# EAGLE design Window_door_Sensor (EAGLE 6.4)
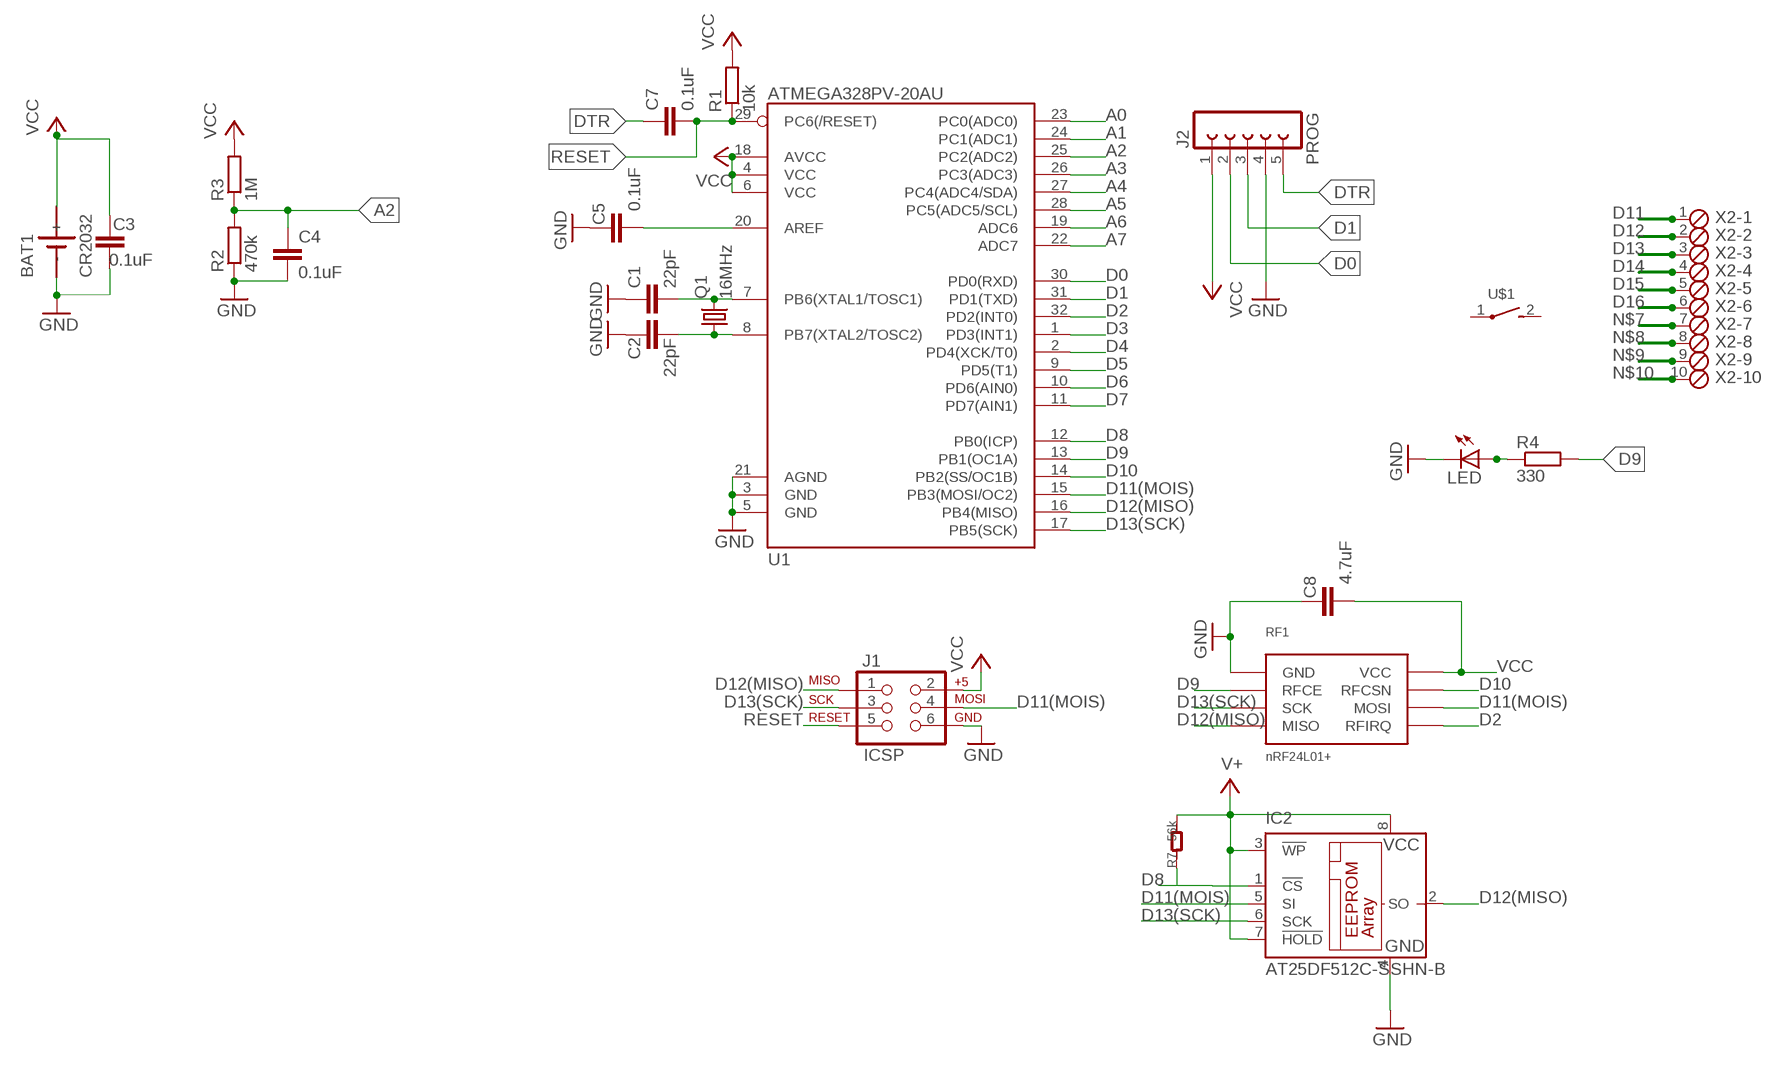
[diagram p0: schematic, sheet 1]

## Parts
BAT1  CR2032  SN2032  [SN2032]
C1  22pF  C-EUC0805  [C0805]
C2  22pF  C-EUC0805  [C0805]
C3  0.1uF  C-EUC0805  [C0805]
C4  0.1uF  C-EUC0805  [C0805]
C5  0.1uF  C-EUC0805  [C0805]
C7  0.1uF  C-EUC0805  [C0805]
C8  4.7uF  C-EUC1206K  [C1206K]
IC2  AT25DF512C-SSHN-B  25AA080SN  [SO-08]
J1  ICSP  AVR_SPI_PRG_6NS  [2X3-NS]
LED  LEDCHIP-LED0805  [CHIP-LED0805]
PROG  J2  FE05-1  [FE05-1]
Q1  16MHz  CRYSTALCTS406  [CTS406]
R1  10k  R-EU_R0805  [R0805]
R2  470k  R-EU_R0805  [R0805]
R3  1M  R-EU_R0805  [R0805]
R4  330  R-EU_R0805  [R0805]
R7  56k  R-0805  [R0805]
RF1  nRF24L01+  NRF24L01  [2X4-2.54MM]
U1  ATMEGA328PV-20AU  ATMEGA328_SMT  [TQFP32-08]
U$1  MK15-B-2""  [16X2,5]
X2  MPT10  [10POL254]

## Nets
A0: U1.23(PC0(ADC0))
A1: U1.24(PC1(ADC1))
A2: C4.1 R2.2 R3.1 U1.25(PC2(ADC2))
A3: U1.26(PC3(ADC3))
A4: U1.27(PC4(ADC4/SDA))
A5: U1.28(PC5(ADC5/SCL))
A6: U1.19(ADC6)
A7: U1.22(ADC7)
D0: PROG.2 U1.30(PD0(RXD))
D1: PROG.3 U1.31(PD1(TXD))
D2: RF1.P$8(RFIRQ) U1.32(PD2(INT0))
D3: U1.1(PD3(INT1))
D4: U1.2(PD4(XCK/T0))
D5: U1.9(PD5(T1))
D6: U1.10(PD6(AIN0))
D7: U1.11(PD7(AIN1))
D8: IC2.1(!CS) R7.1 U1.12(PB0(ICP))
D9: R4.2 RF1.P$3(RFCE) U1.13(PB1(OC1A))
D10: RF1.P$4(RFCSN) U1.14(PB2(SS/OC1B))
D11: X2.1
D11(MOIS): IC2.5(SI) J1.4 RF1.P$6(MOSI) U1.15(PB3(MOSI/OC2))
D12: X2.2
D12(MISO): IC2.2(SO) J1.1 RF1.P$7(MISO) U1.16(PB4(MISO))
D13: X2.3
D13(SCK): IC2.6(SCK) J1.3 RF1.P$5(SCK) U1.17(PB5(SCK))
D14: X2.4
D15: X2.5
D16: X2.6
DTR: C7.1 PROG.5
GND: BAT1.- C1.1 C2.1 C3.1 C4.2 C5.2 C8.2 IC2.4(GND) J1.6 LED.C PROG.4 R2.1 RF1.P$1(GND) U1.3(GND) U1.5(GND) U1.21(AGND)
N$1: C1.2 Q1.3 U1.7(PB6(XTAL1/TOSC1))
N$2: C2.2 Q1.1 U1.8(PB7(XTAL2/TOSC2))
N$5: C5.1 U1.20(AREF)
N$6: LED.A R4.1
N$7: X2.7
N$8: X2.8
N$9: X2.9
N$10: X2.10
RESET: C7.2 J1.5 R1.1 U1.29(PC6(/RESET))
VCC: BAT1.+ C3.2 C8.1 IC2.3(!WP) IC2.7(!HOLD) IC2.8(VCC) J1.2 PROG.1 R1.2 R3.2 R7.2 RF1.P$2(VCC) U1.4(VCC) U1.6(VCC) U1.18(AVCC) ; supply symbol labelled V+
Unconnected: U$1.1(P) U$1.2(S)

## Library data of the parts
BAT1 = sn2032:SN2032: LI BATTERY
C1-C5 C7 C8 = rcl:C-EU: CAPACITOR, European symbol
IC2 = microchip:25*: Serial EEPROM 4K/ 8K , SPI bus; MF: MICROCHIP; MPN: 25AA080/SN; OC_FARNELL: 1816072; OC_NEWARK: 92C7351
J1 = SparkFun-Connectors:AVR_SPI_PRG_6: AVR ISP 6 Pin This is the reduced ISP connector for AVR programming. Common on Arduino. This footprint will take up less PCB space and can be used with a 10-pin to 6-pin adapter such as SKU: BOB-08508
LED = led:LED: LED OSRAM: - CHIPLED LG R971, LG N971, LY N971, LG Q971, LY Q971, LO R971, LY R971 LH N974, LH R974 LS Q976, LO Q976, LY Q976 LO Q996 - Hyper CHIPLED LW Q18S LB Q993, LB Q99A, LB R99A - SideLED LS A670, LO A670, LY A670, LG A670, LP A670 LB A673, LV A673, LT A673, LW A673 LH A674 LY A675 LS A676, LA A676, LO A676, LY A676, LW A676 LS A679, LY A679, LG A679 - Hyper Micro SIDELED® LS Y876, LA Y876, LO Y876, LY Y876 LT Y87S - SmartLED LW L88C, LW L88S LB L89C, LB L89S, LG L890 LS L89K, LO L89K, LY L89K LS L896, LA L896, LO L896, LY L896 - TOPLED LS T670, LO T670, LY T670, LG T670, LP T670 LSG T670, LSP T670, LSY T670, LOP T670, LYG T670 LG T671, LOG T671, LSG T671 LB T673, LV T673, LT T673, LW T673 LH T674 LS T676, LA T676, LO T676, LY T676, LB T676, LH T676, LSB T676, LW T676 LB T67C, LV T67C, LT T67C, LS T67K, LO T67K, LY T67K, LW E67C LS E67B, LA E67B, LO E67B, LY E67B, LB E67C, LV E67C, LT E67C LW T67C LS T679, LY T679, LG T679 LS T770, LO T770, LY T770, LG T770, LP T770 LB T773, LV T773, LT T773, LW T773 LH T774 LS E675, LA E675, LY E675, LS T675 LS T776, LA T776, LO T776, LY T776, LB T776 LHGB T686 LT T68C, LB T68C - Hyper Mini TOPLED® LB M676 - Mini TOPLED Santana® LG M470 LS M47K, LO M47K, LY M47K Source: http://www.osram.convergy.de LUXEON: - LUMILED® LXK2-PW12-R00, LXK2-PW12-S00, LXK2-PW14-U00, LXK2-PW14-V00 LXK2-PM12-R00, LXK2-PM12-S00, LXK2-PM14-U00 LXK2-PE12-Q00, LXK2-PE12-R00, LXK2-PE12-S00, LXK2-PE14-T00, LXK2-PE14-U00 LXK2-PB12-K00, LXK2-PB12-L00, LXK2-PB12-M00, LXK2-PB14-N00, LXK2-PB14-P00, LXK2-PB14-Q00 LXK2-PR12-L00, LXK2-PR12-M00, LXK2-PR14-Q00, LXK2-PR14-R00 LXK2-PD12-Q00, LXK2-PD12-R00, LXK2-PD12-S00 LXK2-PH12-R00, LXK2-PH12-S00 LXK2-PL12-P00, LXK2-PL12-Q00, LXK2-PL12-R00 Source: www.luxeon.com KINGBRIGHT: KA-3528ASYC Source: www.kingbright.com
PROG = con-lsta-my:FE05-1: FEMALE HEADER; OC_FARNELL: unknown; OC_NEWARK: unknown
Q1 = crystal:CRYSTAL: CRYSTAL; OC_FARNELL: unknown; OC_NEWARK: unknown
R1-R4 = rcl:R-EU_: RESISTOR, European symbol
R7 = Discrete:R*
RF1 = matrix:NRF24L01
U1 = SparkFun-DigitalIC:ATMEGA328_SMT: 32-Pin Atmega328 part Commonly used on Arduino compatible boards Available in QFP and QFN packages TQFP is IC-09069 QFN is non-stock; PROD_ID: IC-09069; VALUE: ATMEGA328P
U$1 = MEDER:MK15-B-2: REED,16x2.5mm, SMD
X2 = con-phoenix-254:MPT10: PHOENIX CONNECTOR

## Net classes
0 default: width 0.203 mm
1 Power: width 0.406 mm

## Board
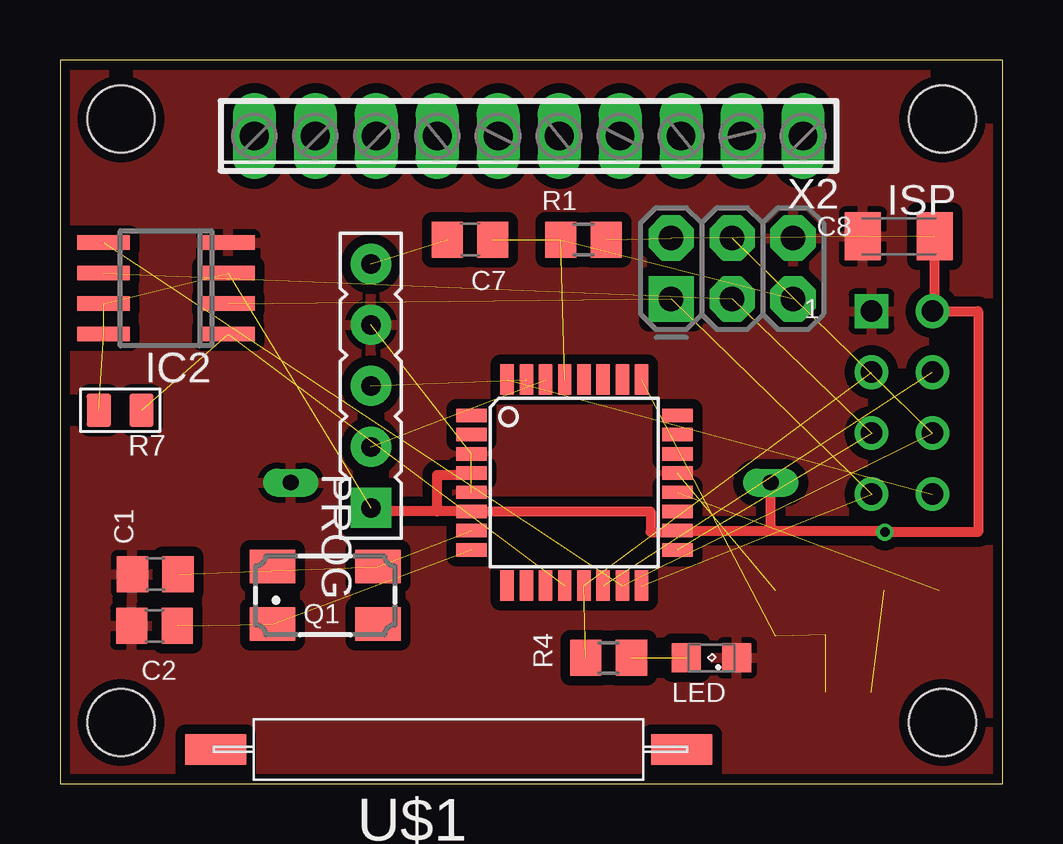
[diagram p1: board, top side]
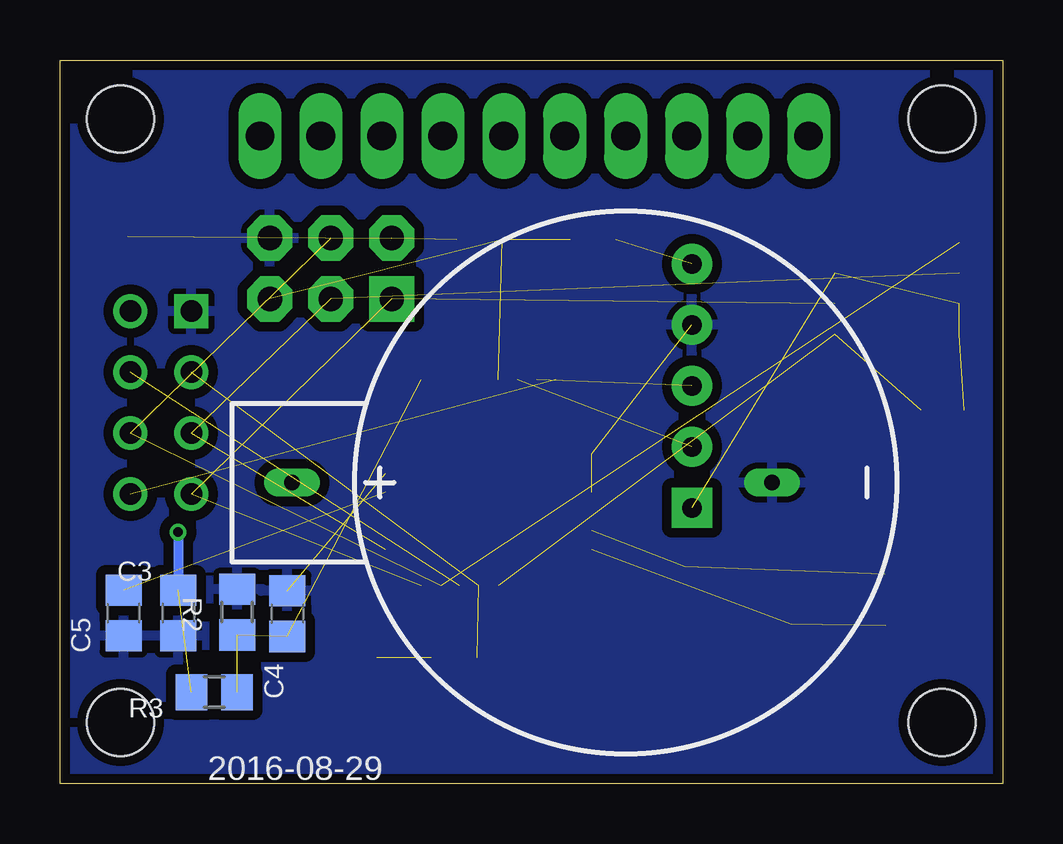
[diagram p2: board, bottom side, seen from below]

Size 39.29 x 30.15 mm. Coordinates in mm from the lower left corner, seen from the top.
Outline: 0,0 39.29,0 39.29,30.15 0,30.15 0,0
Copper layers (1*16): Top 0.035mm / dielectric 1.5mm / Bottom 0.035mm
Design rules "default": minimum track width 6mil, minimum drill 12mil, track to track 6mil, track to pad 6mil, pad to pad 6mil, via to via 6mil, smd to smd 0mil, copper to edge 10mil, drill to drill 10mil, minimum pad ring 10mil, minimum via ring 6mil, stop-mask expansion 2mil, vias tented up to drill 100mil, thermal gap 10mil
Holes 2.8 mm at 2.54,2.54 36.77,2.54 2.54,27.69 36.77,27.69

### Footprints (pad centres in the part's own frame; a part is rotated, then mirrored left to right if it is on the bottom)
SN2032 = drill 0.65 long: + 0,13.9; - 0,-6.1
C0805 = smd 1.3 x 1.5: 1 -0.95,0; 2 0.95,0
C1206K = smd 1.5 x 2: 1 -1.5,0; 2 1.5,0
SO-08 = smd 0.6 x 2.2: 1 -1.905,-2.6; 2 -0.635,-2.6; 3 0.635,-2.6; 4 1.905,-2.6; 5 1.905,2.6; 6 0.635,2.6; 7 -0.635,2.6; 8 -1.905,2.6
2X3-NS@1 = drill 1.016 pad 1.88 square: 1 -2.54,-1.27 | drill 1.016 pad 1.88 octagon: 2 -2.54,1.27; 3 0,-1.27; 4 0,1.27; 5 2.54,-1.27; 6 2.54,1.27
SML0805 = smd 1.2 x 1.2: A 1.05,0; C -1.05,0
FE05-1 = drill 0.813 pad 1.676 square: 1 -5.08,0 | drill 0.813 pad 1.676: 2 -2.54,0; 3 0,0; 4 2.54,0; 5 5.08,0
CTS406 = smd 1.9 x 1.4: 1 -2.2,-1.2; 2 2.2,-1.2; 3 2.2,1.2; 4 -2.2,1.2
R0805 = smd 1.3 x 1.5: 1 -0.95,0; 2 0.95,0
R0805' = smd 1.397 x 1.016: 1 0,0.889; 2 0,-0.889
2X4-2.54MM = drill 0.9 square: P$1 0,0 | drill 0.9: P$2 2.54,0; P$3 0,-2.54; P$4 2.54,-2.54; P$5 0,-5.08; P$6 2.54,-5.08; P$7 0,-7.62; P$8 2.54,-7.62
TQFP32-08 = smd 1.27 x 0.559: 1 -4.293,2.8; 2 -4.293,2; 3 -4.293,1.2; 4 -4.293,0.4; 5 -4.293,-0.4; 6 -4.293,-1.2; 7 -4.293,-2; 8 -4.293,-2.8; 17 4.293,-2.8; 18 4.293,-2; 19 4.293,-1.2; 20 4.293,-0.4; 21 4.293,0.4; 22 4.293,1.2; 23 4.293,2; 24 4.293,2.8 | smd 0.559 x 1.27: 9 -2.8,-4.293; 10 -2,-4.293; 11 -1.2,-4.293; 12 -0.4,-4.293; 13 0.4,-4.293; 14 1.2,-4.293; 15 2,-4.293; 16 2.8,-4.293; 25 2.8,4.293; 26 2,4.293; 27 1.2,4.293; 28 0.4,4.293; 29 -0.4,4.293; 30 -1.2,4.293; 31 -2,4.293; 32 -2.8,4.293
16X2,5 = smd 2.54 x 1.27: 1 -9.71,0; 2 9.71,0
10POL254 = drill 1.2 long: 1 -11.43,0; 2 -8.89,0; 3 -6.35,0; 4 -3.81,0; 5 -1.27,0; 6 1.27,0; 7 3.81,0; 8 6.35,0; 9 8.89,0; 10 11.43,0

### Placement (x,y rotation side)
BAT1  15.72,12.54 90 bottom
C1  3.97,8.73 0 top
C2  3.94,6.57 0 top
C3  34.35,7.11 90 bottom
C4  29.81,7.08 90 bottom
C5  36.64,7.11 270 bottom
C7  17.08,22.67 0 top
C8  34.96,22.8 180 top
IC2  4.41,20.64 90 top
J1  ICSP  [2X3-NS@1]  28,21.46 0 top
LED  [SML0805]  27.15,5.24 180 top
PROG  12.95,16.57 90 top
Q1  11.05,7.84 0 top
R1  21.81,22.67 0 top
R2  31.91,7.14 270 bottom
R3  32.86,3.81 180 bottom
R4  22.86,5.24 180 top
R7  56k  [R0805']  2.51,15.56 270 top
RF1  33.81,19.69 0 top
U1  21.43,12.54 0 top
U$1  16.19,1.43 0 top
X2  19.53,26.99 180 top

### Tracks (layer width: path | path; a pad name or v marks a point on that pad's centre or on a via)
A2  (3 unrouted)
D0  (1 unrouted)
D1  (1 unrouted)
D2  (1 unrouted)
D8  (2 unrouted)
D9  (2 unrouted)
D10  (1 unrouted)
D11(MOIS)  (3 unrouted)
D12(MISO)  (3 unrouted)
D13(SCK)  (3 unrouted)
DTR  (1 unrouted)
GND  (3 unrouted)
  pour Top (isolate 0.406): -1.27,31.11 41.27,31.11 41.27,-1.27 -1.27,-1.27
  pour Bottom (isolate 0.406): -1.27,31.11 41.27,31.11 41.27,-1.27 -1.27,-1.27
N$1  (2 unrouted)
N$2  (2 unrouted)
N$5  (1 unrouted)
N$6  (1 unrouted)
RESET  (3 unrouted)
VCC  (via drill 0.4)  (7 unrouted)
  Top 0.406: 15.72,11.34 U1.6 24.61,11.34 24.61,10.48 25.72,10.48 U1.18 29.69,10.54 | 15.72,11.34 15.72,12.86 17.14,12.86 U1.4 | 15.72,11.34 12.95,11.34 PROG.1 | 29.69,10.54 29.69,10.64 29.62,10.64 BAT1.+ | 29.69,10.54 34.29,10.54 v34.37,10.48 38.26,10.48 38.26,19.69 RF1.P$2 36.51,19.69 36.51,19.84 36.46,19.84 C8.1
  Bottom 0.406: v34.37,10.48 34.35,9.53 C3.2

### Text on the board
tNames: ISP | 1
bNames: 2016-08-29